# Altium schematic sheet CPU ROM.SchDoc
size A4; SheetNumber: 9; SheetTotal: 15
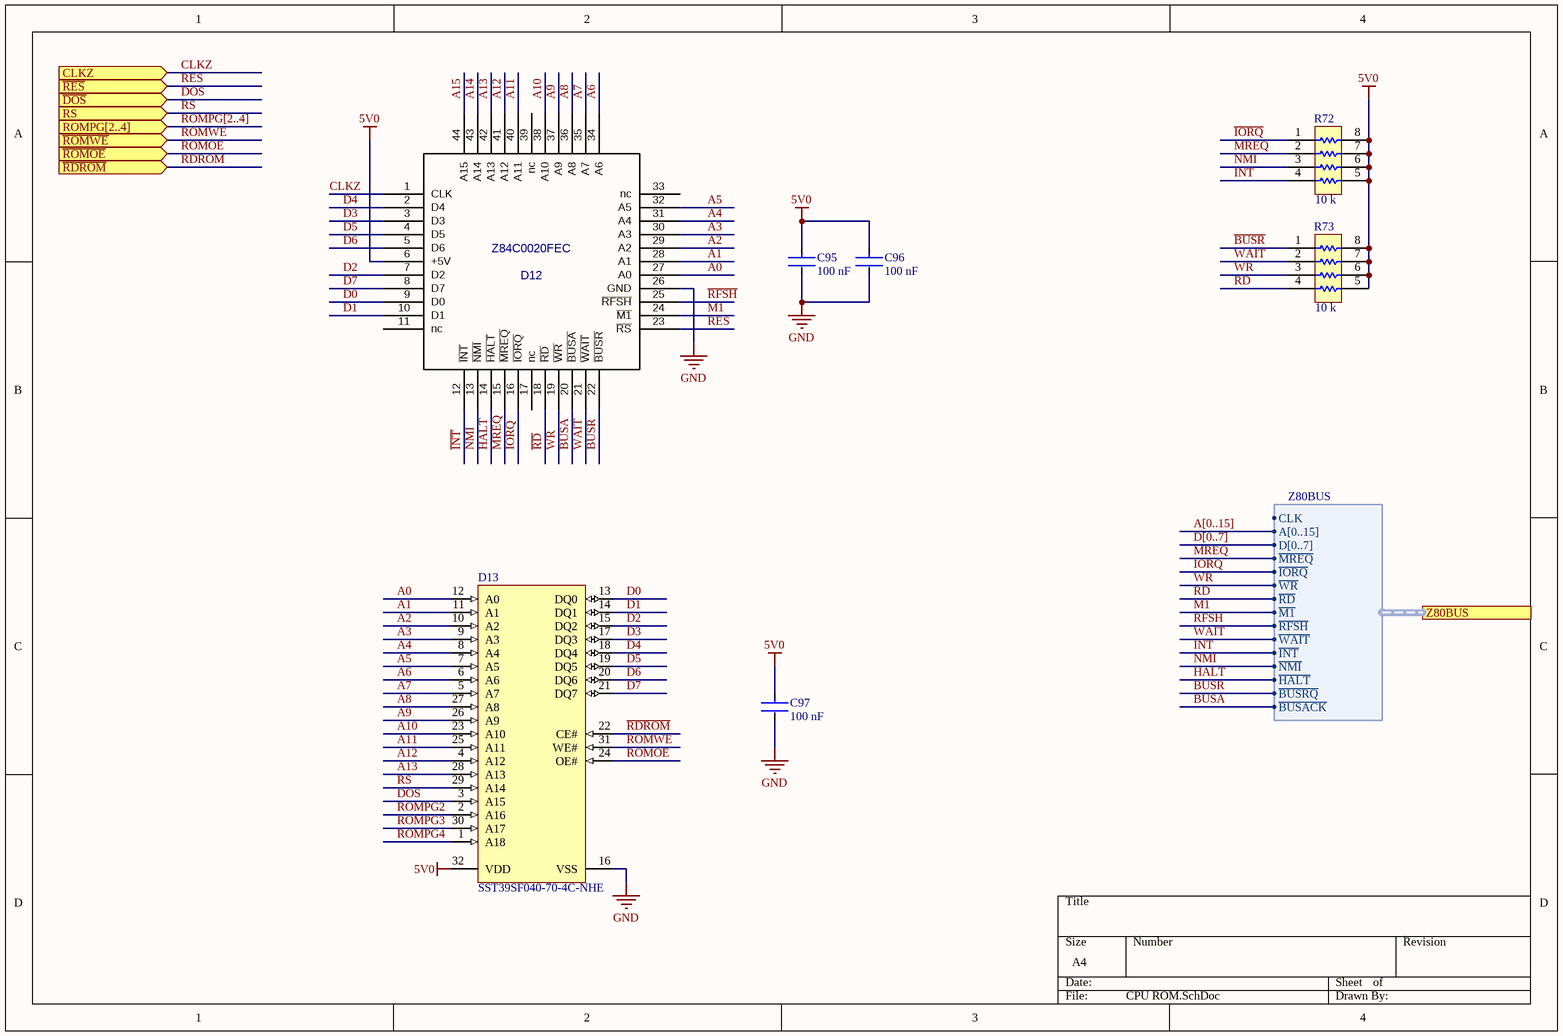
[diagram p0: CPU ROM.SchDoc]

## Parts
C95  Capacitance: 100 nF  [CC0805]  (hidden comment: CC0805-1.5pF)
C96  Capacitance: 100 nF  [CC0805]  (hidden comment: CC0805-1.5pF)
C97  Capacitance: 100 nF  [CC0805]  (hidden comment: CC0805-1.5pF)
D12  Z84C0020FEC  [QFP44X8]
D13  SST39SF040-70-4C-NHE  [MCHP-PLCC-NH32_L]
R72  Resistance: 10 k  [BOUR-CAY16-J4_V]  (hidden comment: CAY16-103J4LF)
R73  Resistance: 10 k  [BOUR-CAY16-J4_V]  (hidden comment: CAY16-103J4LF)

## Ports
CLKZ (in), ROMPG[2..4] (in), RS (in), Z80BUS (harness Z80BUS), ~{DOS} (in), ~{RDROM} (in), ~{RES} (in), ~{ROMOE} (in), ~{ROMWE} (in)

## Harnesses
Z80BUS: A[0..15], D[0..7], ~{MREQ}, ~{IORQ}, ~{WR}, ~{RD}, ~{M1}, ~{RFSH}, ~{WAIT}, ~{INT}, ~{NMI}, ~{HALT}, ~{BUSRQ}, ~{BUSACK}, CLK

## Nets
5V0: C95.1 C96.1 C97.1 D12.6(+5V) D13.32(VDD) R72.5 R72.6 R72.7 R72.8 R73.5 R73.6 R73.7 R73.8
GND: C95.2 C96.2 C97.2 D12.26(GND) D13.16(VSS)
A0: D12.27(A0) D13.12(A0)
A1: D12.28(A1) D13.11(A1)
A2: D12.29(A2) D13.10(A2)
A3: D12.30(A3) D13.9(A3)
A4: D12.31(A4) D13.8(A4)
A5: D12.32(A5) D13.7(A5)
A6: D12.34(A6) D13.6(A6)
A7: D12.35(A7) D13.5(A7)
A8: D12.36(A8) D13.27(A8)
A9: D12.37(A9) D13.26(A9)
A10: D12.38(A10) D13.23(A10)
A11: D12.40(A11) D13.25(A11)
A12: D12.41(A12) D13.4(A12)
A13: D12.42(A13) D13.28(A13)
A14: D12.43(A14)
A15: D12.44(A15)
~{BUSA}: D12.20(~{BUSA}) ; port Z80BUS.~{BUSACK}
~{BUSR}: D12.22(~{BUSR}) R73.1 ; port Z80BUS.~{BUSRQ}
CLKZ: D12.1(CLK) ; port CLKZ
D0: D12.9(D0) D13.13(DQ0)
D1: D12.10(D1) D13.14(DQ1)
D2: D12.7(D2) D13.15(DQ2)
D3: D12.3(D3) D13.17(DQ3)
D4: D12.2(D4) D13.18(DQ4)
D5: D12.4(D5) D13.19(DQ5)
D6: D12.5(D6) D13.20(DQ6)
D7: D12.8(D7) D13.21(DQ7)
~{DOS}: D13.3(A15) ; port ~{DOS}
~{HALT}: D12.14(~{HALT}) ; port Z80BUS.~{HALT}
~{INT}: D12.12(~{INT}) R72.4 ; port Z80BUS.~{INT}
~{IORQ}: D12.16(~{IORQ}) R72.1 ; port Z80BUS.~{IORQ}
~{M1}: D12.24(~{M1}) ; port Z80BUS.~{M1}
~{MREQ}: D12.15(~{MREQ}) R72.2 ; port Z80BUS.~{MREQ}
~{NMI}: D12.13(~{NMI}) R72.3 ; port Z80BUS.~{NMI}
~{RD}: D12.18(~{RD}) R73.4 ; port Z80BUS.~{RD}
~{RDROM}: D13.22(CE#) ; port ~{RDROM}
~{RES}: D12.23(~{RS}) ; port ~{RES}
~{RFSH}: D12.25(~{RFSH}) ; port Z80BUS.~{RFSH}
~{ROMOE}: D13.24(OE#) ; port ~{ROMOE}
~{ROMWE}: D13.31(WE#) ; port ~{ROMWE}
ROMPG2: D13.2(A16)
ROMPG3: D13.30(A17)
ROMPG4: D13.1(A18)
RS: D13.29(A14) ; port RS
~{WAIT}: D12.21(~{WAIT}) R73.2 ; port Z80BUS.~{WAIT}
~{WR}: D12.19(~{WR}) R73.3 ; port Z80BUS.~{WR}

Not connected (* = marked no-connect by the designer): D12 11(nc) 17(nc) 33(nc) 39(nc)

## Buses and harness runs
bus A[0..15]
bus D[0..7]
bus ROMPG[2..4] = port ROMPG[2..4]

## Library data of the parts
C95-C97 = CC0805: CL21 Series 0805 1.5pF 50V ±0.25pF Tolerance C0G Multilayer Ceramic Chip Capacitor; Manufacturer Part Number: CL21C1R5CBANNNC; Manufacturer: Samsung; value: 1.5pF; Category: Cap; Case/Package: 0805
D13 = SST39SF040-70-4C-NHE: 4 Mbit Multi-Purpose Flash, 4.5 to 5.5 V, 1 kHz, 0 to 70 degC, 32-pin PLCC (NH32), Tube; Manufacturer: Microchip; PartNumber: SST39SF040-70-4C-NHE; PackageDescription: 32-lead Plastic Lead Chip Carrier, 11.43 x 13.97 mm Body, 1.27 mm Pitch; Manufacturer Part Number: SST39SF040-70-4C-NHE; value: SST39SF040-70-4C-NHE; Case/Package: PLCC-32; Category: IC
R72 R73 = CMP-1747-00005-1: Chip Resistor Array, 10 KOhm, +/- 5%, 62.5 mW, -55 to 125 degC, 8-Pin SMD, RoHS, Tape and Reel; Power Rating: 100 mW; Case\Package: 0603; Voltage Rating: 75 V; Tolerance: 1%; Packaging: Tape and Reel; Min Operating Temperature: -55 degC; Pins: 2; Radiation Hardening: No; DatasheetVersion: Jan-15; Length: 0.063 inch; RoHSCompliant: true; Mount: Surface Mount; ComponentLink1Description: Manufacturer URL; ComponentLink1URL: http://www.bourns.com/; Weight: 7.1E-05 oz; ComponentLink2URL: http://www.bourns.com/docs/Product-Datasheets/CATCAY.pdf; PackageReference: CAY16-J4; Width: 0.031 inch; Case Code (Imperial): 0603; Case Code (Metric): 1608; REACH SVHC: Yes; Max Operating Temperature: 155 degC; ComponentLink2Description: Datasheet; Height: 0.022 inch; PackageDescription: 8-Pin Surface Mount Device, Body 1.6 x 3.2 mm, Pitch 0.8 mm
D12 = Z84C0020FEC: Value: Z84C0020FEC; Case/Package: QFP-44; Category: IC